# Altium project 02SignalDetect.PrjPcb
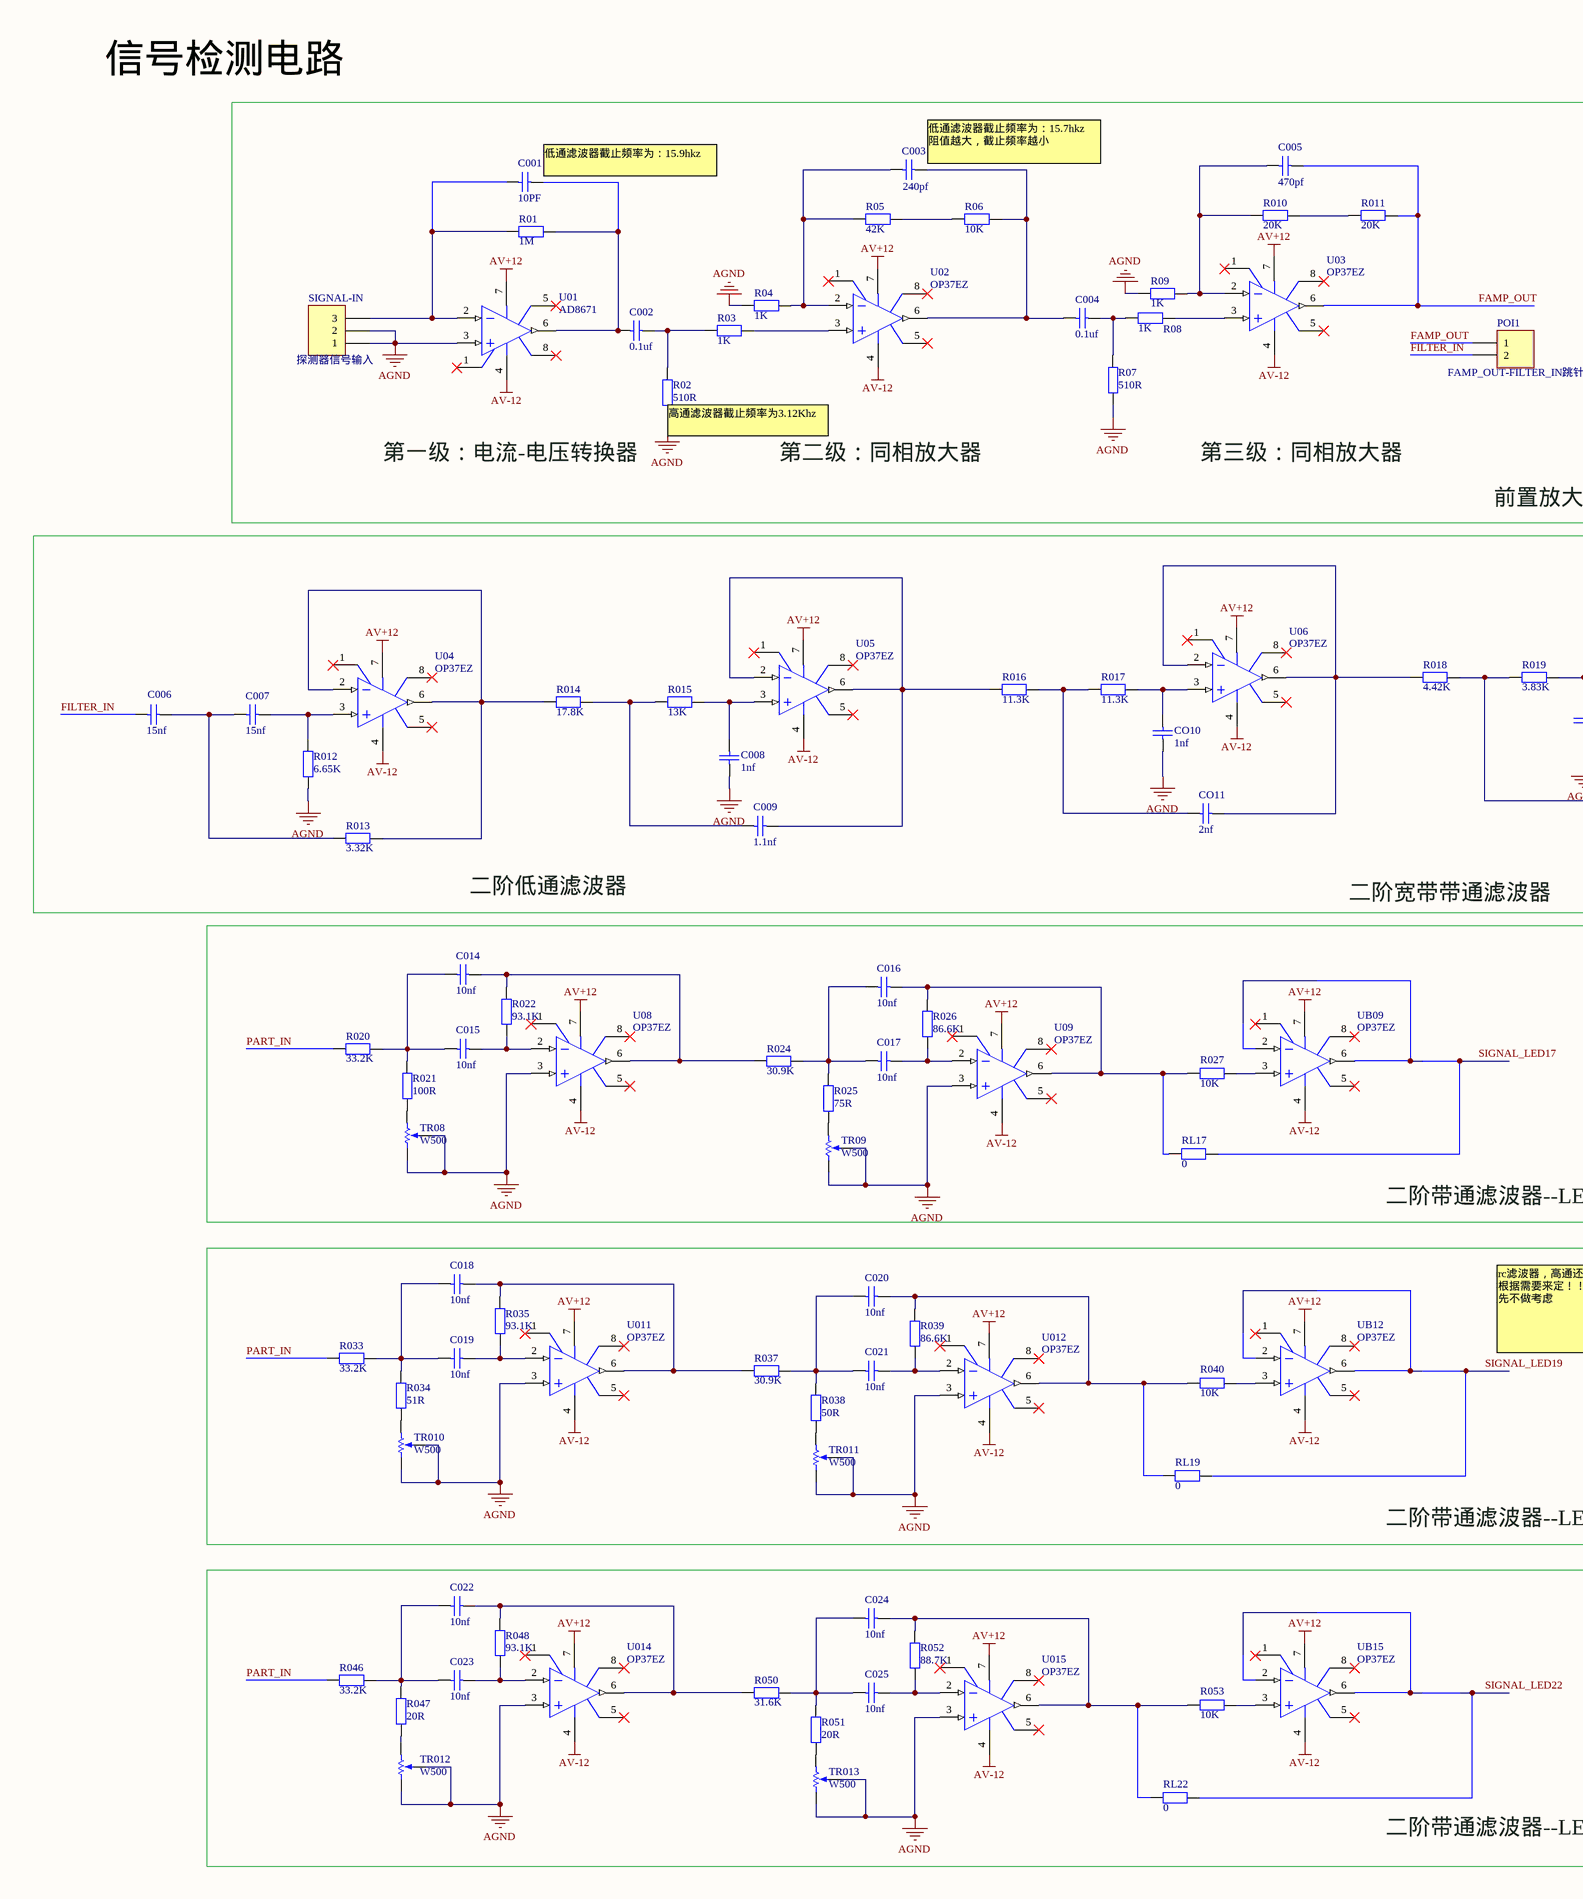
[diagram p0: 01SignalDetect.SchDoc, left]
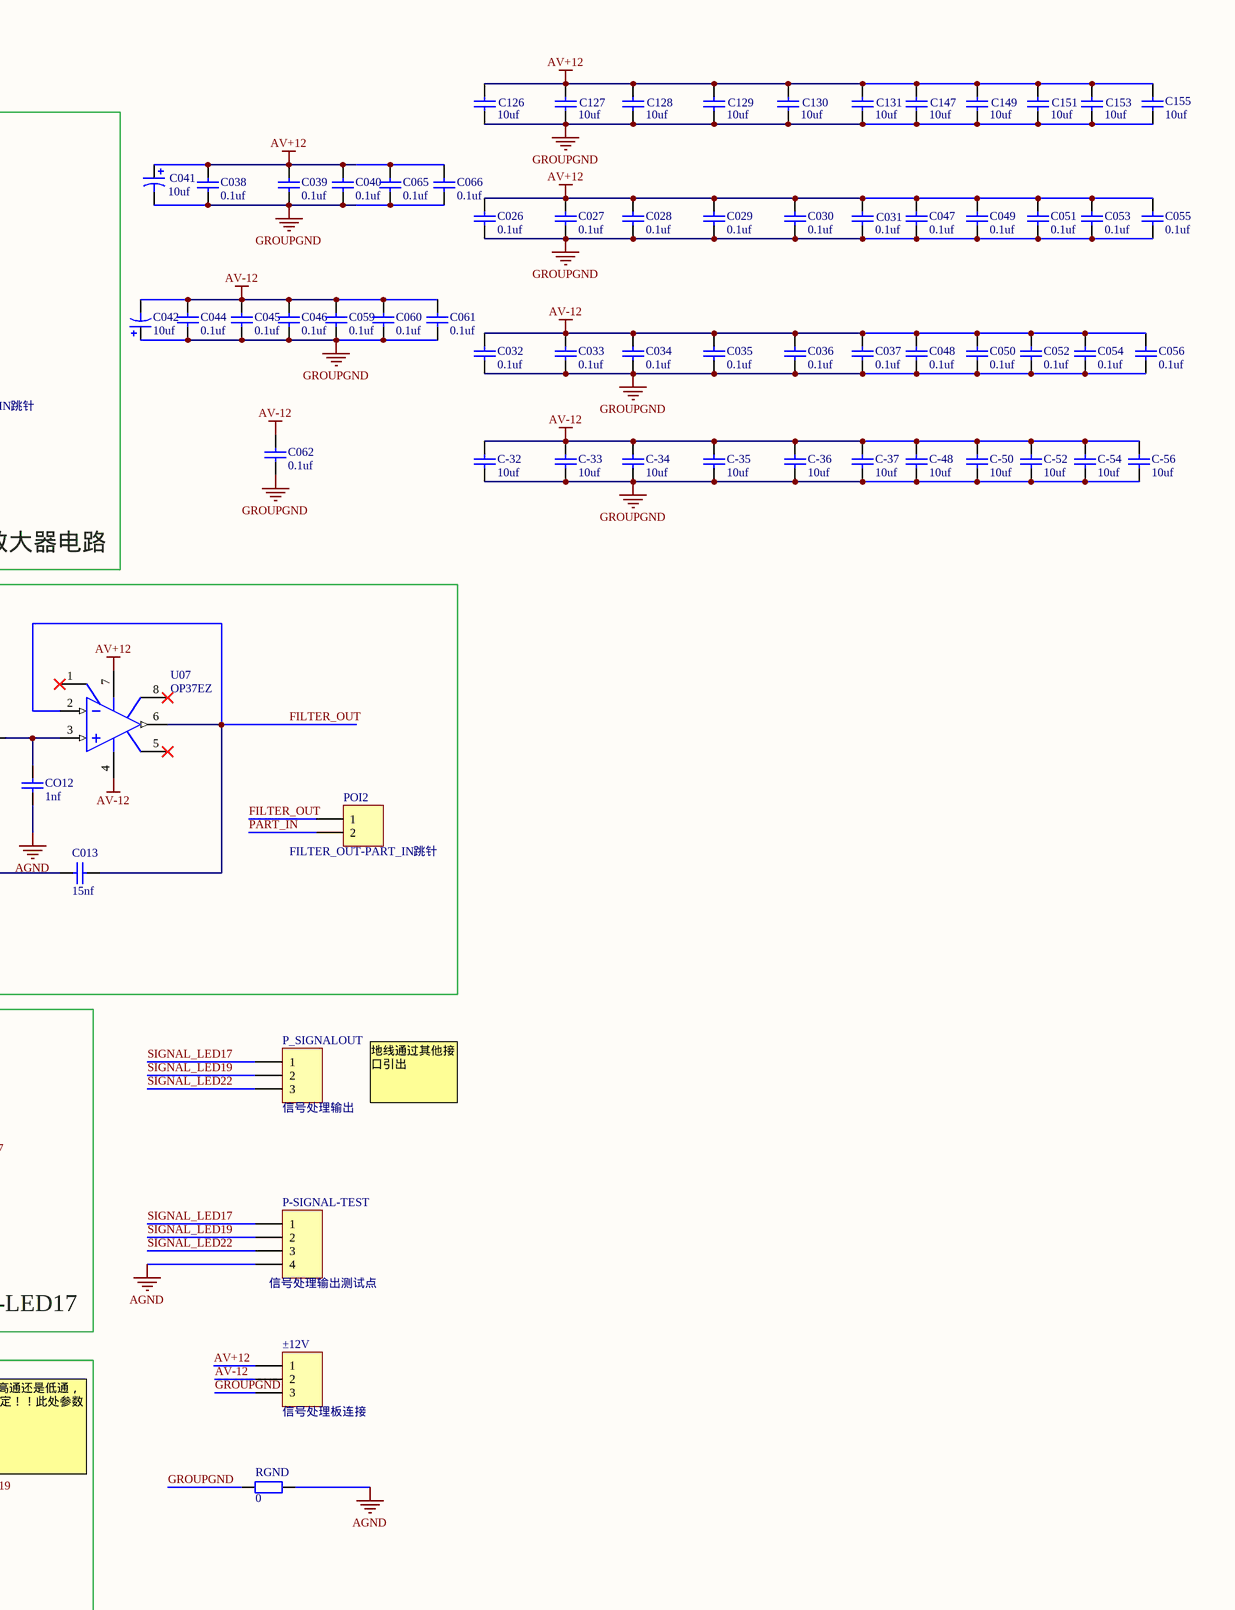
[diagram p1: 01SignalDetect.SchDoc, right]
1 sheet, 155 parts. Net scope: global (net labels, ports and power ports of the same name join across sheets).
Board file: 01SignalDetect.PcbDoc

## Sheet 01SignalDetect.SchDoc
size A2

### Parts
C001  value 10PF  [CC0805]  (hidden comment: Cap)
C002  value 0.1uf  [CC0805]  (hidden comment: Cap)
C003  value 240pf  [CC0805]  (hidden comment: Cap)
C004  value 0.1uf  [CC0805]  (hidden comment: Cap)
C005  value 470pf  [CC0805]  (hidden comment: Cap)
C006  value 15nf  [CC0805]  (hidden comment: Cap)
C007  value 15nf  [CC0805]  (hidden comment: Cap)
C008  value 1nf  [CC0805]  (hidden comment: Cap)
C009  value 1.1nf  [CC0805]  (hidden comment: Cap)
C013  value 15nf  [CC0805]  (hidden comment: Cap)
C014  value 10nf  [校正电容]  (hidden comment: Cap)
C015  value 10nf  [校正电容]  (hidden comment: Cap)
C016  value 10nf  [校正电容]  (hidden comment: Cap)
C017  value 10nf  [校正电容]  (hidden comment: Cap)
C018  value 10nf  [校正电容]  (hidden comment: Cap)
C019  value 10nf  [校正电容]  (hidden comment: Cap)
C020  value 10nf  [校正电容]  (hidden comment: Cap)
C021  value 10nf  [校正电容]  (hidden comment: Cap)
C022  value 10nf  [校正电容]  (hidden comment: Cap)
C023  value 10nf  [校正电容]  (hidden comment: Cap)
C024  value 10nf  [校正电容]  (hidden comment: Cap)
C025  value 10nf  [校正电容]  (hidden comment: Cap)
C026  value 0.1uf  [CC0805]  (hidden comment: Cap)
C027  value 0.1uf  [CC0805]  (hidden comment: Cap)
C028  value 0.1uf  [CC0805]  (hidden comment: Cap)
C029  value 0.1uf  [CC0805]  (hidden comment: Cap)
C030  value 0.1uf  [CC0805]  (hidden comment: Cap)
C031  value 0.1uf  [CC0805]  (hidden comment: Cap)
C032  value 0.1uf  [CC0805]  (hidden comment: Cap)
C033  value 0.1uf  [CC0805]  (hidden comment: Cap)
C034  value 0.1uf  [CC0805]  (hidden comment: Cap)
C035  value 0.1uf  [CC0805]  (hidden comment: Cap)
C036  value 0.1uf  [CC0805]  (hidden comment: Cap)
C037  value 0.1uf  [CC0805]  (hidden comment: Cap)
C038  value 0.1uf  [CC0805]  (hidden comment: Cap)
C039  value 0.1uf  [CC0805]  (hidden comment: Cap)
C040  value 0.1uf  [CC0805]  (hidden comment: Cap)
C041  value 10uf  [4*4.5 贴片电解电容]  (hidden comment: Cap Pol1)
C042  value 10uf  [4*4.5 贴片电解电容]  (hidden comment: Cap Pol1)
C044  value 0.1uf  [CC0805]  (hidden comment: Cap)
C045  value 0.1uf  [CC0805]  (hidden comment: Cap)
C046  value 0.1uf  [CC0805]  (hidden comment: Cap)
C047  value 0.1uf  [CC0805]  (hidden comment: Cap)
C048  value 0.1uf  [CC0805]  (hidden comment: Cap)
C049  value 0.1uf  [CC0805]  (hidden comment: Cap)
C050  value 0.1uf  [CC0805]  (hidden comment: Cap)
C051  value 0.1uf  [CC0805]  (hidden comment: Cap)
C052  value 0.1uf  [CC0805]  (hidden comment: Cap)
C053  value 0.1uf  [CC0805]  (hidden comment: Cap)
C054  value 0.1uf  [CC0805]  (hidden comment: Cap)
C055  value 0.1uf  [CC0805]  (hidden comment: Cap)
C056  value 0.1uf  [CC0805]  (hidden comment: Cap)
C059  value 0.1uf  [CC0805]  (hidden comment: Cap)
C060  value 0.1uf  [CC0805]  (hidden comment: Cap)
C061  value 0.1uf  [CC0805]  (hidden comment: Cap)
C062  value 0.1uf  [CC0805]  (hidden comment: Cap)
C065  value 0.1uf  [CC0805]  (hidden comment: Cap)
C066  value 0.1uf  [CC0805]  (hidden comment: Cap)
C126  value 10uf  [CC0805]  (hidden comment: Cap)
C127  value 10uf  [CC0805]  (hidden comment: Cap)
C128  value 10uf  [CC0805]  (hidden comment: Cap)
C129  value 10uf  [CC0805]  (hidden comment: Cap)
C130  value 10uf  [CC0805]  (hidden comment: Cap)
C131  value 10uf  [CC0805]  (hidden comment: Cap)
C147  value 10uf  [CC0805]  (hidden comment: Cap)
C149  value 10uf  [CC0805]  (hidden comment: Cap)
C151  value 10uf  [CC0805]  (hidden comment: Cap)
C153  value 10uf  [CC0805]  (hidden comment: Cap)
C155  value 10uf  [CC0805]  (hidden comment: Cap)
C-32  value 10uf  [CC0805]  (hidden comment: Cap)
C-33  value 10uf  [CC0805]  (hidden comment: Cap)
C-34  value 10uf  [CC0805]  (hidden comment: Cap)
C-35  value 10uf  [CC0805]  (hidden comment: Cap)
C-36  value 10uf  [CC0805]  (hidden comment: Cap)
C-37  value 10uf  [CC0805]  (hidden comment: Cap)
C-48  value 10uf  [CC0805]  (hidden comment: Cap)
C-50  value 10uf  [CC0805]  (hidden comment: Cap)
C-52  value 10uf  [CC0805]  (hidden comment: Cap)
C-54  value 10uf  [CC0805]  (hidden comment: Cap)
C-56  value 10uf  [CC0805]  (hidden comment: Cap)
CO10  value 1nf  [CC0805]  (hidden comment: Cap)
CO11  value 2nf  [CC0805]  (hidden comment: Cap)
CO12  value 1nf  [CC0805]  (hidden comment: Cap)
P-SIGNAL-TEST  信号处理输出测试点  [HDR1X4]
P_SIGNALOUT  信号处理输出  [HDR1X3H]
POI1  FAMP_OUT-FILTER_IN跳针  [HDR1X2]
POI2  FILTER_OUT-PART_IN跳针  [HDR1X2]
R01  value 1M  [AXIAL-0.4]  (hidden comment: Res2)
R02  value 510R  [0805]  (hidden comment: Res2)
R03  value 1K  [0805]  (hidden comment: Res2)
R04  value 1K  [0805]  (hidden comment: Res2)
R05  value 42K  [0805]  (hidden comment: Res2)
R06  value 10K  [0805]  (hidden comment: Res2)
R07  value 510R  [0805]  (hidden comment: Res2)
R08  value 1K  [0805]  (hidden comment: Res2)
R09  value 1K  [0805]  (hidden comment: Res2)
R010  value 20K  [0805]  (hidden comment: Res2)
R011  value 20K  [0805]  (hidden comment: Res2)
R012  value 6.65K  [0805]  (hidden comment: Res2)
R013  value 3.32K  [0805]  (hidden comment: Res2)
R014  value 17.8K  [0805]  (hidden comment: Res2)
R015  value 13K  [0805]  (hidden comment: Res2)
R016  value 11.3K  [0805]  (hidden comment: Res2)
R017  value 11.3K  [0805]  (hidden comment: Res2)
R018  value 4.42K  [0805]  (hidden comment: Res2)
R019  value 3.83K  [0805]  (hidden comment: Res2)
R020  value 33.2K  [0805]  (hidden comment: Res2)
R021  value 100R  [0805]  (hidden comment: Res2)
R022  value 93.1K  [0805]  (hidden comment: Res2)
R024  value 30.9K  [0805]  (hidden comment: Res2)
R025  value 75R  [0805]  (hidden comment: Res2)
R026  value 86.6K  [0805]  (hidden comment: Res2)
R027  value 10K  [0805]  (hidden comment: Res2)
R033  value 33.2K  [0805]  (hidden comment: Res2)
R034  value 51R  [0805]  (hidden comment: Res2)
R035  value 93.1K  [0805]  (hidden comment: Res2)
R037  value 30.9K  [0805]  (hidden comment: Res2)
R038  value 50R  [0805]  (hidden comment: Res2)
R039  value 86.6K  [0805]  (hidden comment: Res2)
R040  value 10K  [0805]  (hidden comment: Res2)
R046  value 33.2K  [0805]  (hidden comment: Res2)
R047  value 20R  [0805]  (hidden comment: Res2)
R048  value 93.1K  [0805]  (hidden comment: Res2)
R050  value 31.6K  [0805]  (hidden comment: Res2)
R051  value 20R  [0805]  (hidden comment: Res2)
R052  value 88.7K  [0805]  (hidden comment: Res2)
R053  value 10K  [0805]  (hidden comment: Res2)
RGND  value 0  [0805]  (hidden comment: Res2)
RL17  value 0  [0805]  (hidden comment: Res2)
RL19  value 0  [0805]  (hidden comment: Res2)
RL22  value 0  [0805]  (hidden comment: Res2)
SIGNAL-IN  探测器信号输入  [HDR1X3H]
TR08  value W500  [VR5]  (hidden comment: RPot)
TR09  value W500  [VR5]  (hidden comment: RPot)
TR010  value W500  [VR5]  (hidden comment: RPot)
TR011  value W500  [VR5]  (hidden comment: RPot)
TR012  value W500  [VR5]  (hidden comment: RPot)
TR013  value W500  [VR5]  (hidden comment: RPot)
U01  AD8671  [SO-8-N]
U02  OP37EZ  [SO-8-N]
U03  OP37EZ  [SO-8-N]
U04  OP37EZ  [SO-8-N]
U05  OP37EZ  [SO-8-N]
U06  OP37EZ  [SO-8-N]
U07  OP37EZ  [SO-8-N]
U08  OP37EZ  [SO-8-N]
U09  OP37EZ  [SO-8-N]
U011  OP37EZ  [SO-8-N]
U012  OP37EZ  [SO-8-N]
U014  OP37EZ  [SO-8-N]
U015  OP37EZ  [SO-8-N]
UB09  OP37EZ  [SO-8-N]
UB12  OP37EZ  [SO-8-N]
UB15  OP37EZ  [SO-8-N]
±12V  信号处理板连接  [HDR1X3H]

### Blocks framed on the sheet
二阶带通滤波器--LED17: C014 C015 C016 C017 R020 R021 R022 R024 R025 R026 R027 RL17 TR08 TR09 U08 U09 UB09
二阶带通滤波器--LED19: C018 C019 C020 C021 R033 R034 R035 R037 R038 R039 R040 RL19 TR010 TR011 U011 U012 UB12
二阶带通滤波器--LED22: C022 C023 C024 C025 R046 R047 R048 R050 R051 R052 R053 RL22 TR012 TR013 U014 U015 UB15

### Nets
AGND: C008.2 CO10.1 CO12.1 P-SIGNAL-TEST.4 R02.1 R04.1 R07.1 R09.1 R012.1 RGND.1 SIGNAL-IN.1 SIGNAL-IN.2 TR08.1(TOP) TR08.2(TAP) TR09.1(TOP) TR09.2(TAP) TR010.1(TOP) TR010.2(TAP) TR011.1(TOP) TR011.2(TAP) TR012.1(TOP) TR012.2(TAP) TR013.1(TOP) TR013.2(TAP) U01.3(IN+) U08.3(IN+) U09.3(IN+) U011.3(IN+) U012.3(IN+) U014.3(IN+) U015.3(IN+)
AV+12: C026.1 C027.1 C028.1 C029.1 C030.1 C031.1 C038.1 C039.1 C040.1 C041.1 C047.1 C049.1 C051.1 C053.1 C055.1 C065.1 C066.1 C126.1 C127.1 C128.1 C129.1 C130.1 C131.1 C147.1 C149.1 C151.1 C153.1 C155.1 U01.7(V+) U02.7(V+) U03.7(V+) U04.7(V+) U05.7(V+) U06.7(V+) U07.7(V+) U08.7(V+) U09.7(V+) U011.7(V+) U012.7(V+) U014.7(V+) U015.7(V+) UB09.7(V+) UB12.7(V+) UB15.7(V+) ±12V.1
AV-12: C032.1 C033.1 C034.1 C035.1 C036.1 C037.1 C042.2 C044.1 C045.1 C046.1 C048.1 C050.1 C052.1 C054.1 C056.1 C059.1 C060.1 C061.1 C062.1 C-32.1 C-33.1 C-34.1 C-35.1 C-36.1 C-37.1 C-48.1 C-50.1 C-52.1 C-54.1 C-56.1 U01.4(V-) U02.4(V-) U03.4(V-) U04.4(V-) U05.4(V-) U06.4(V-) U07.4(V-) U08.4(V-) U09.4(V-) U011.4(V-) U012.4(V-) U014.4(V-) U015.4(V-) UB09.4(V-) UB12.4(V-) UB15.4(V-) ±12V.2
GROUPGND: C026.2 C027.2 C028.2 C029.2 C030.2 C031.2 C032.2 C033.2 C034.2 C035.2 C036.2 C037.2 C038.2 C039.2 C040.2 C041.2 C042.1 C044.2 C045.2 C046.2 C047.2 C048.2 C049.2 C050.2 C051.2 C052.2 C053.2 C054.2 C055.2 C056.2 C059.2 C060.2 C061.2 C062.2 C065.2 C066.2 C126.2 C127.2 C128.2 C129.2 C130.2 C131.2 C147.2 C149.2 C151.2 C153.2 C155.2 C-32.2 C-33.2 C-34.2 C-35.2 C-36.2 C-37.2 C-48.2 C-50.2 C-52.2 C-54.2 C-56.2 RGND.2 ±12V.3
FAMP_OUT: C005.1 POI1.1 R011.2 U03.6(OUT)
FILTER_IN: C006.2 POI1.2
FILTER_OUT: C013.1 POI2.1 U07.2(IN-) U07.6(OUT)
PART_IN: POI2.2 R020.1 R033.1 R046.1
SIGNAL_LED17: P-SIGNAL-TEST.1 P_SIGNALOUT.1 RL17.1 UB09.2(IN-) UB09.6(OUT)
SIGNAL_LED19: P-SIGNAL-TEST.2 P_SIGNALOUT.2 RL19.1 UB12.2(IN-) UB12.6(OUT)
SIGNAL_LED22: P-SIGNAL-TEST.3 P_SIGNALOUT.3 RL22.1 UB15.2(IN-) UB15.6(OUT)
NetC001_1: C001.1 C002.2 R01.2 U01.6(OUT)
NetC001_2: C001.2 R01.1 SIGNAL-IN.3 U01.2(IN-)
NetC002_1: C002.1 R02.2 R03.1
NetC003_1: C003.1 C004.2 R06.2 U02.6(OUT)
NetC003_2: C003.2 R04.2 R05.1 U02.2(IN-)
NetC004_1: C004.1 R07.2 R08.1
NetC005_2: C005.2 R09.2 R010.1 U03.2(IN-)
NetC006_1: C006.1 C007.2 R013.2
NetC007_1: C007.1 R012.2 U04.3(IN+)
NetC008_1: C008.1 R015.1 U05.3(IN+)
NetC009_1: C009.1 R016.1 U05.2(IN-) U05.6(OUT)
NetC009_2: C009.2 R014.2 R015.2
NetC013_2: C013.2 R018.2 R019.1
NetC014_1: C014.1 R022.2 R024.1 U08.6(OUT)
NetC014_2: C014.2 C015.2 R020.2 R021.2
NetC015_1: C015.1 R022.1 U08.2(IN-)
NetC016_1: C016.1 R026.2 R027.2 RL17.2 U09.6(OUT)
NetC016_2: C016.2 C017.2 R024.2 R025.2
NetC017_1: C017.1 R026.1 U09.2(IN-)
NetC018_1: C018.1 R035.2 R037.1 U011.6(OUT)
NetC018_2: C018.2 C019.2 R033.2 R034.2
NetC019_1: C019.1 R035.1 U011.2(IN-)
NetC020_1: C020.1 R039.2 R040.2 RL19.2 U012.6(OUT)
NetC020_2: C020.2 C021.2 R037.2 R038.2
NetC021_1: C021.1 R039.1 U012.2(IN-)
NetC022_1: C022.1 R048.2 R050.1 U014.6(OUT)
NetC022_2: C022.2 C023.2 R046.2 R047.2
NetC023_1: C023.1 R048.1 U014.2(IN-)
NetC024_1: C024.1 R052.2 R053.2 RL22.2 U015.6(OUT)
NetC024_2: C024.2 C025.2 R050.2 R051.2
NetC025_1: C025.1 R052.1 U015.2(IN-)
NetCO10_2: CO10.2 R017.2 U06.3(IN+)
NetCO11_1: CO11.1 R018.1 U06.2(IN-) U06.6(OUT)
NetCO11_2: CO11.2 R016.2 R017.1
NetCO12_2: CO12.2 R019.2 U07.3(IN+)
NetR03_2: R03.2 U02.3(IN+)
NetR05_2: R05.2 R06.1
NetR08_2: R08.2 U03.3(IN+)
NetR010_2: R010.2 R011.1
NetR013_1: R013.1 R014.1 U04.2(IN-) U04.6(OUT)
NetR021_1: R021.1 TR08.3(BOT)
NetR025_1: R025.1 TR09.3(BOT)
NetR027_1: R027.1 UB09.3(IN+)
NetR034_1: R034.1 TR010.3(BOT)
NetR038_1: R038.1 TR011.3(BOT)
NetR040_1: R040.1 UB12.3(IN+)
NetR047_1: R047.1 TR012.3(BOT)
NetR051_1: R051.1 TR013.3(BOT)
NetR053_1: R053.1 UB15.3(IN+)

Not connected (* = marked no-connect by the designer): U01 1(BAL)* 5(NC)* 8(BAL)*; U02 1(VOSTRIM)* 5(NC)* 8(VOSTRIM)*; U03 1(VOSTRIM)* 5(NC)* 8(VOSTRIM)*; U04 1(VOSTRIM)* 5(NC)* 8(VOSTRIM)*; U05 1(VOSTRIM)* 5(NC)* 8(VOSTRIM)*; U06 1(VOSTRIM)* 5(NC)* 8(VOSTRIM)*; U07 1(VOSTRIM)* 5(NC)* 8(VOSTRIM)*; U08 1(VOSTRIM)* 5(NC)* 8(VOSTRIM)*; U09 1(VOSTRIM)* 5(NC)* 8(VOSTRIM)*; U011 1(VOSTRIM)* 5(NC)* 8(VOSTRIM)*; U012 1(VOSTRIM)* 5(NC)* 8(VOSTRIM)*; U014 1(VOSTRIM)* 5(NC)* 8(VOSTRIM)*; U015 1(VOSTRIM)* 5(NC)* 8(VOSTRIM)*; UB09 1(VOSTRIM)* 5(NC)* 8(VOSTRIM)*; UB12 1(VOSTRIM)* 5(NC)* 8(VOSTRIM)*; UB15 1(VOSTRIM)* 5(NC)* 8(VOSTRIM)*

### Notes on the sheet
- 信号检测电路
- (near C001) 低通滤波器截止频率为：15.9hkz
- (near C003) 低通滤波器截止频率为：15.7hkz
  阻值越大，截止频率越小
- (near R02) 高通滤波器截止频率为3.12Khz
- 第一级：电流-电压转换器
- 第二级：同相放大器
- 第三级：同相放大器
- 前置放大器电路
- 二阶低通滤波器
- 二阶宽带带通滤波器
- 地线通过其他接口引出
- rc滤波器，高通还是低通，根据需要来定！！此处参数先不做考虑

### Library data of the parts
C001 C002 C003 C004 C005 C006 C007 C008 C009 C013 C014 C015 C016 C017 C018 C019 C020 C021 C022 C023 C024 C025 C026 C027 C028 C029 C030 C031 C032 C033 C034 C035 C036 C037 C038 C039 C040 C044 C045 C046 C047 C048 C049 C050 C051 C052 C053 C054 C055 C056 C059 C060 C061 C062 C065 C066 C126-C131 C147 C149 C151 C153 C155 C-32-C-37 C-48 C-50 C-52 C-54 C-56 CO10-CO12 = Cap: Capacitor; Published: 8-Jun-2000; LatestRevisionDate: 17-Jul-2002; LatestRevisionNote: Re-released for DXP Platform.; PackageReference: RAD-0.3; Publisher: Altium Limited
C041 C042 = Cap Pol1: Polarized Capacitor (Radial); Published: 8-Jun-2000; LatestRevisionDate: 17-Jul-2002; LatestRevisionNote: Re-released for DXP Platform.; PackageReference: RB7.6-15; Publisher: Altium Limited
P-SIGNAL-TEST = Header 4: Header, 4-Pin; LatestRevisionDate: 17-Jul-2002; LatestRevisionNote: Re-released for DXP Platform.; Publisher: Altium Limited
P_SIGNALOUT SIGNAL-IN ±12V = Header 3H: Header, 3-Pin, Right Angle; LatestRevisionDate: 17-Jul-2002; LatestRevisionNote: Re-released for DXP Platform.; Publisher: Altium Limited
POI1 POI2 = Header 2: Header, 2-Pin; LatestRevisionDate: 17-Jul-2002; LatestRevisionNote: Re-released for DXP Platform.; Publisher: Altium Limited
R01 R02 R03 R04 R05 R06 R07 R08 R09 R010 R011 R012 R013 R014 R015 R016 R017 R018 R019 R020 R021 R022 R024 R025 R026 R027 R033 R034 R035 R037 R038 R039 R040 R046 R047 R048 R050 R051 R052 R053 RGND RL17 RL19 RL22 = Res2: Resistor; Published: 8-Jun-2000; LatestRevisionDate: 17-Jul-2002; LatestRevisionNote: Re-released for DXP Platform.; PackageReference: AXIAL-0.4; Publisher: Altium Limited
TR08 TR09 TR010 TR011 TR012 TR013 = RPot: Potentiometer; Sim Note: Enter the Resistance value and the set point into parameter fields.; Set Position: 0.5; Published: 8-Jun-2000; LatestRevisionDate: 17-Jul-2002; LatestRevisionNote: Re-released for DXP Platform.; PackageReference: VR5; Publisher: Altium Limited
U01 = OP27FJ: Low-Noise, Precision Operational Amplifier; Note: Pin 5 is not connected; Pin 4 connected to case.; Published: 8-Jun-2000; LatestRevisionDate: 17-Jul-2002; LatestRevisionNote: Re-released for DXP Platform.; DatasheetVersion: 1992; PackageVersion: 1990; PackageReference: H-08A; Publisher: Altium Limited; PackageDescription: Can; 8 Leads; Pin Circle Dia. 5.08 mm; Lead Dia. 0.53 mm (max); ComponentLink1Description: Manufacturer Link; ComponentLink1URL: http://www.analog.com/en/prod/0,,759_786_OP27%2C00.html; ComponentLink2Description: Datasheet; ComponentLink2URL: http://www.analog.com/UploadedFiles/Data_Sheets/314538596OP27_c.pdf
U02 U03 U04 U05 U06 U07 U08 U09 U011 U012 U014 U015 UB09 UB12 UB15 = OP37EZ: Low-Noise, Precision, High-Speed Operational Amplifier (Avcl >= 5); Note: Pin 5 is not connected.; Published: 8-Jun-2000; LatestRevisionDate: 04-Mar-2005; LatestRevisionNote: Stylized 3D Model Added.; DatasheetVersion: 1992; PackageVersion: 1998; PackageReference: Q-8; Publisher: Altium Limited; PackageDescription: DIP; 8 Leads; Row Spacing 7.62 mm; Pitch 2.54 mm; ComponentLink1Description: Manufacturer Link; ComponentLink1URL: http://www.analog.com/en/prod/0,,759_786_OP37%2C00.html; ComponentLink2Description: Datasheet; ComponentLink2URL: http://www.analog.com/UploadedFiles/Data_Sheets/5021673OP37_b.pdf